# EAGLE design Passive Mult (EAGLE 8.0.0)
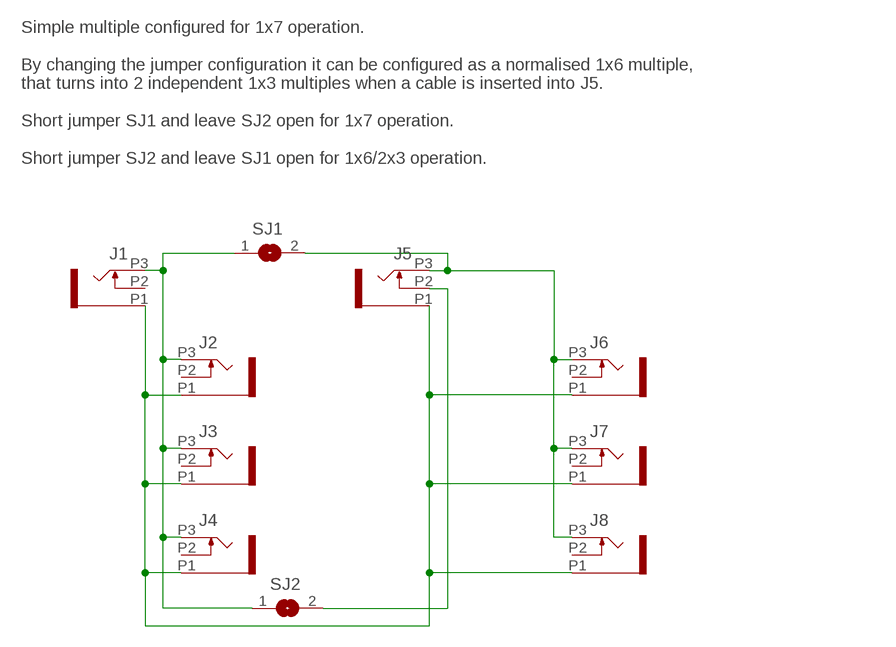
[diagram p0: schematic, sheet 1]

## Parts
J1  OG-PJ301_PJ301_THONKICONN4  [OG-PJ301_WQP_PJ_301M4]
J2  OG-PJ301_PJ301_THONKICONN4  [OG-PJ301_WQP_PJ_301M4]
J3  OG-PJ301_PJ301_THONKICONN4  [OG-PJ301_WQP_PJ_301M4]
J4  OG-PJ301_PJ301_THONKICONN4  [OG-PJ301_WQP_PJ_301M4]
J5  OG-PJ301_PJ301_THONKICONN4  [OG-PJ301_WQP_PJ_301M4]
J6  OG-PJ301_PJ301_THONKICONN4  [OG-PJ301_WQP_PJ_301M4]
J7  OG-PJ301_PJ301_THONKICONN4  [OG-PJ301_WQP_PJ_301M4]
J8  OG-PJ301_PJ301_THONKICONN4  [OG-PJ301_WQP_PJ_301M4]
SJ1  SJ  [SJ]
SJ2  SJ  [SJ]

## Nets
GND: J1.P1 J2.P1 J3.P1 J4.P1 J5.P1 J6.P1 J7.P1 J8.P1
N$1: J5.P2 SJ2.2
N$2: J1.P3 J2.P3 J3.P3 J4.P3 SJ1.1 SJ2.1
N$6: J5.P3 J6.P3 J7.P3 J8.P3 SJ1.2
Unconnected: J1.P2 J2.P2 J3.P2 J4.P2 J6.P2 J7.P2 J8.P2

## Notes on the sheet
- Simple multiple configured for 1x7 operation. 
  
  By changing the jumper configuration it can be configured as a normalised 1x6 multiple, 
  that turns into 2 independent 1x3 multiples when a cable is inserted into J5. 
  
  Short jumper SJ1 and leave SJ2 open for 1x7 operation. 
  
  Short jumper SJ2 and leave SJ1 open for 1x6/2x3 operation.

## Library data of the parts
J1-J8 = tomatek_ver_0.1:OG-PJ301_PJ301_THONKICONN
SJ1 SJ2 = jumper:SJ: SMD solder JUMPER

## Board
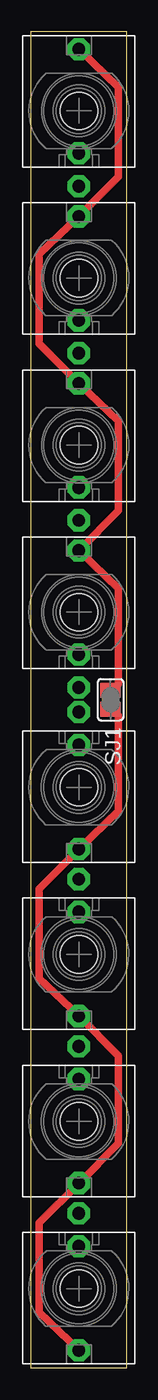
[diagram p1: board, top side]
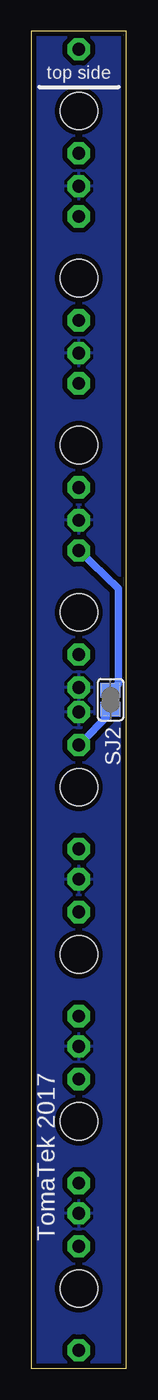
[diagram p2: board, bottom side, seen from below]

Size 7.62 x 106.68 mm. Coordinates in mm from the lower left corner, seen from the top.
Outline: 7.62,106.68 7.62,0 0,0 0,106.68 7.62,106.68
Copper layers (1*16): Top 0.035mm / dielectric 1.5mm / Bottom 0.035mm
Design rules "dirt_cheap_dirty_boards.v1": minimum track width 5mil, minimum drill 12mil, track to track 5mil, track to pad 5mil, pad to pad 5mil, via to via 5mil, smd to smd 0mil, copper to edge 10mil, drill to drill 10mil, minimum pad ring 10mil, minimum via ring 6mil, stop-mask expansion 2mil, vias tented up to drill 25mil, thermal gap 10mil

### Footprints (pad centres in the part's own frame; a part is rotated, then mirrored left to right if it is on the bottom)
OG-PJ301_WQP_PJ_301M4 = drill 1.016 pad 1.778 octagon: P1 0,-6; P2 0,-3.38; P3 0,4.92 | hole 3: 0,0
SJ = smd 1.168 x 1.6: 1 -0.762,0; 2 0.762,0

### Placement (x,y rotation side)
J1  3.81,100.33 0 top
J2  3.81,87 0 top
J3  3.81,73.66 0 top
J4  3.81,60.33 0 top
J5  3.81,46.35 180 top
J6  3.81,33.02 180 top
J7  3.81,19.69 180 top
J8  3.81,6.35 180 top
SJ1  6.35,53.34 270 top
SJ2  1.27,53.34 270 bottom
U$1  [OG-EURORACK-TEMPLATE_EURORACK_TEMPLATE]  -21.59,117.48 0 top  (outside the outline)

### Tracks (layer width: path | path; a pad name or v marks a point on that pad's centre or on a via)
GND
  pour Bottom (isolate 0.406): 0,0 7.62,0 7.62,106.68 0,106.68
N$1
  Bottom 0.61: SJ2.2 1.27,52.27 J5.P2
N$2
  Top 0.61: J1.P3 6.99,102.23 6.99,95.09 J2.P3 0.64,88.9 0.64,81.75 J3.P3 6.99,75.56 6.99,68.42 J4.P3 6.99,62.23 6.99,54.61 SJ1.1
  Bottom 0.61: J4.P3 0.64,62.23 0.64,54.61 SJ2.1
N$6
  Top 0.61: J8.P3 0.64,4.45 0.64,11.59 J7.P3 6.99,17.94 6.99,24.92 J6.P3 0.64,31.11 0.64,38.26 J5.P3 6.99,44.45 6.99,52.07 SJ1.2

### Text on the board
bsilk: top side | TomaTek 2017